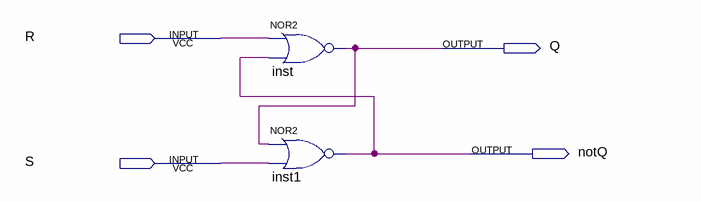
[diagram p0: schematic sheet]
// Quartus schematic lab9step1.bdf as structural Verilog: 2 symbols, 4 pins
module lab9step1 (
  input  R,
  input  S,
  output Q,
  output notQ
);

  nor inst (Q, R, notQ);
  nor inst1 (notQ, Q, S);
endmodule
